# Altium schematic sheet [02] - BLOCK DIAGRAM.SchDoc
size A3; DocumentNumber: 2; SheetNumber: 2; SheetTotal: 4; Organization: Altium Limited; Address1: L3, 12a Rodborough Rd; Address2: Frenchs Forest; Address3: NSW; Address4: Australia 2086
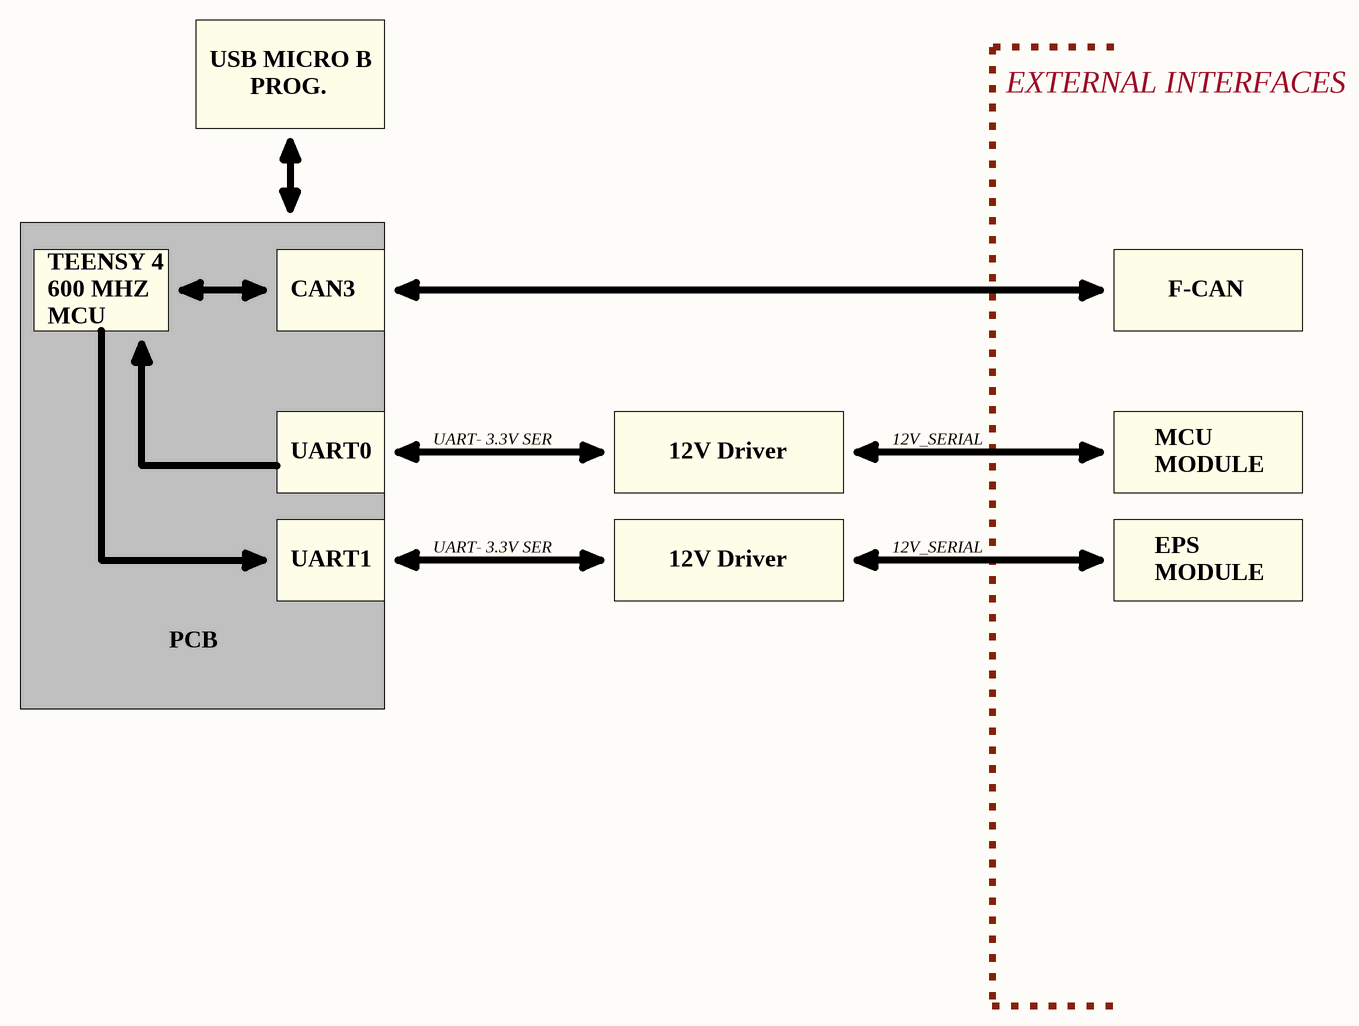
[diagram p0: [02] - BLOCK DIAGRAM.SchDoc]

## Notes on the sheet
- USB MICRO B
- PROG.
- EXTERNAL INTERFACES
- TEENSY 4
- 600 MHZ
- MCU
- CAN3
- F-CAN
- UART0
- UART- 3.3V SER
- 12V Driver
- 12V_SERIAL
- MODULE
- UART1
- Serial
- EPS
- PCB
- Page:
- Size:
- Project:
- A3
- Engineer:
- ML
- Revision:
- Date:
- Time:
- Sheet
- of